# Altium project altum-senior-project-large.PrjPcb
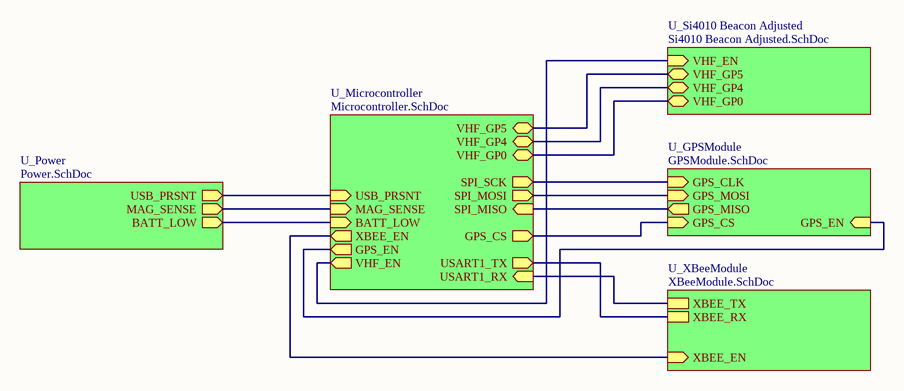
[diagram p0: topLevel.SchDoc]
6 sheets, 92 parts. Net scope: hierarchical (ports join the sheet entries above them; power ports are global).
Board file: largeCollar_AA.PcbDoc
Sheets:
  topLevel.SchDoc
    U_Power = Power.SchDoc
    U_GPSModule = GPSModule.SchDoc
    U_Microcontroller = Microcontroller.SchDoc
    U_Si4010 Beacon Adjusted = Si4010 Beacon Adjusted.SchDoc
    U_XBeeModule = XBeeModule.SchDoc

## Sheet topLevel.SchDoc: Top Level Schematic
size A4; Organization: Grand Valley State University; Address1: 301 W Fulton St; Address2: Grand Rapids, MI; Address3: 49504; Revision: AA; SheetNumber: 1; SheetTotal: 6; ImagePath: "D:\git\altium-senior-project\gvsu_logo.jpg"

### Sub-sheets
U_GPSModule = GPSModule.SchDoc: GPS_CLK (in), GPS_MISO (out), GPS_MOSI (in), GPS_CS (in), GPS_EN (in)
U_Microcontroller = Microcontroller.SchDoc: SPI_SCK (out), SPI_MISO (in), SPI_MOSI (out), GPS_CS (out), XBEE_EN (out), GPS_EN (out), VHF_EN (out), USB_PRSNT (in), MAG_SENSE (in), VHF_GP5 (bidir), VHF_GP4 (bidir), VHF_GP0 (bidir), BATT_LOW (in), USART1_TX (out), USART1_RX (in)
U_Power = Power.SchDoc: USB_PRSNT (out), MAG_SENSE (out), BATT_LOW (out)
U_Si4010 Beacon Adjusted = Si4010 Beacon Adjusted.SchDoc: VHF_EN (in), VHF_GP5 (bidir), VHF_GP4 (bidir), VHF_GP0 (bidir)
U_XBeeModule = XBeeModule.SchDoc: XBEE_EN (in), XBEE_TX, XBEE_RX

### Nets
GP0: sheet U_Microcontroller/VHF_GP0, sheet U_Si4010 Beacon Adjusted/VHF_GP0
GP4: sheet U_Microcontroller/VHF_GP4, sheet U_Si4010 Beacon Adjusted/VHF_GP4
GP5: sheet U_Microcontroller/VHF_GP5, sheet U_Si4010 Beacon Adjusted/VHF_GP5
GPS_CS: sheet U_GPSModule/GPS_CS, sheet U_Microcontroller/GPS_CS
MISO: sheet U_GPSModule/GPS_MISO, sheet U_Microcontroller/SPI_MISO
MOSI: sheet U_GPSModule/GPS_MOSI, sheet U_Microcontroller/SPI_MOSI
SCK: sheet U_GPSModule/GPS_CLK, sheet U_Microcontroller/SPI_SCK
NetQ2_2: sheet U_Power/USB_PRSNT, sheet U_Microcontroller/USB_PRSNT
NetR2_2: sheet U_Power/MAG_SENSE, sheet U_Microcontroller/MAG_SENSE
NetR5_1: sheet U_GPSModule/GPS_EN, sheet U_Microcontroller/GPS_EN
NetR11_1: sheet U_Microcontroller/VHF_EN, sheet U_Si4010 Beacon Adjusted/VHF_EN
NetR14_1: sheet U_Microcontroller/XBEE_EN, sheet U_XBeeModule/XBEE_EN
NetU1_6: sheet U_Microcontroller/USART1_RX, sheet U_XBeeModule/XBEE_TX
NetU1_7: sheet U_Microcontroller/USART1_TX, sheet U_XBeeModule/XBEE_RX
NetU1_25: sheet U_Power/BATT_LOW, sheet U_Microcontroller/BATT_LOW

### Notes on the sheet
- Title
- Size:
- Date:
- A4
- Number:
- Time:
- Revision:
- Sheet
- of
- File:

## Sheet Power.SchDoc: Power Selection
size A4; Revision: AA; SheetNumber: 4; SheetTotal: 6
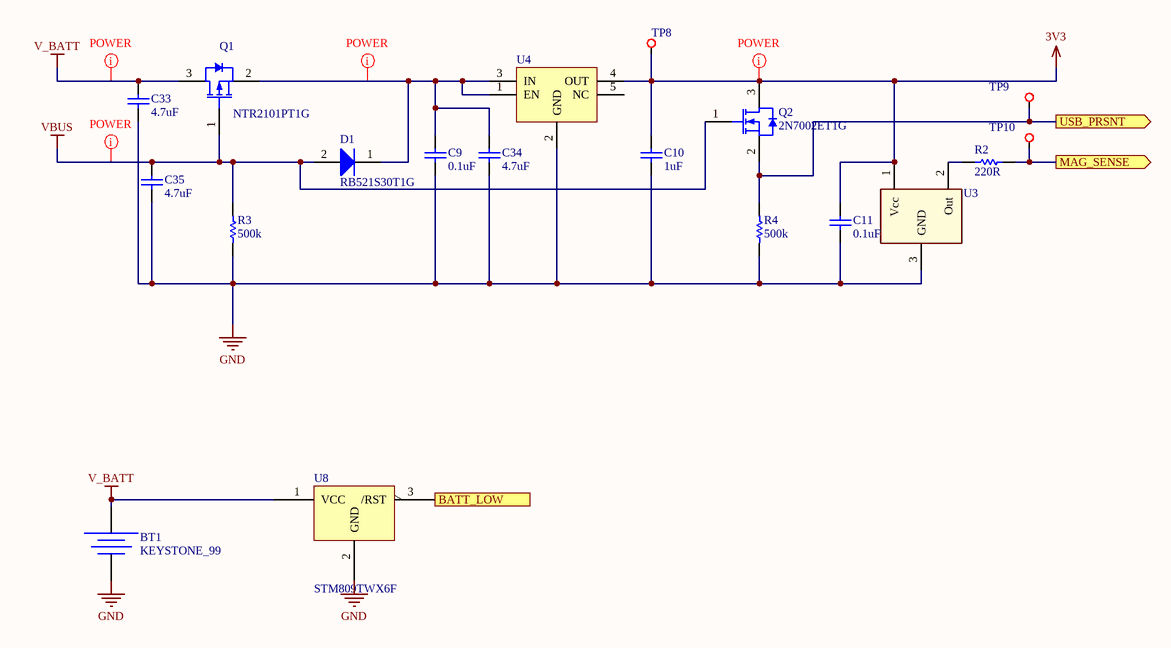
[diagram p1: Power.SchDoc]

### Parts
BT1  KEYSTONE_99  [KEYSTONE_99]
C9  value 0.1uF  [0402cap]  (hidden comment: C0402)
C10  value 1uF  [0402cap]  (hidden comment: C0402)
C11  value 0.1uF  [0402cap]  (hidden comment: C0402)
C33  value 4.7uF  [0603CAP]  (hidden comment: C0603)
C34  value 4.7uF  [0603CAP]  (hidden comment: C0603)
C35  value 4.7uF  [0603CAP]  (hidden comment: C0603)
D1  RB521S30T1G  [ONSC-SOD-523-2-502-01_V]
Q1  NTR2101PT1G  [ONSC-SOT-23-3-318-08_V]
Q2  2N7002ET1G  [ONSC-SOT-23-3-318-08_V]
R2  value 220R  [0402RES]  (hidden comment: R0402)
R3  value 500k  [0402RES]  (hidden comment: R0402)
R4  value 500k  [0402RES]  (hidden comment: R0402)
TP8  TESTPOINT  [TP R25]  (value not drawn)  (no BOM)
TP9  TESTPOINT  [TP R25]  (value not drawn)  (no BOM)
TP10  TESTPOINT  [TP R25]  (value not drawn)  (no BOM)
U3  DRV5032FBDBZT  [SOT-23]  (value not drawn)
U4  IC REG LINEAR 3.3V 200MA ESV  [TCR2EE33,LM(CT]  (value not drawn)
U8  STM809TWX6F  [SOT103P237X112-3N]

### Ports
BATT_LOW (out), MAG_SENSE (out), USB_PRSNT (out)

### Nets
3V3: C10.2 C11.2 Q2.3(D) TP8.1 U3.1(Vcc) U4.4(OUT)
GND: BT1.2(NEG) C9.1 C10.1 C11.1 C33.1 C34.1 C35.1 R3.1 R4.1 U3.3(GND) U4.2(GND) U8.2(GND)
V_BATT: BT1.1(POS) C33.2 Q1.3(D) U8.1(VCC)
VBUS: C35.2 D1.2(A) Q1.1(G) Q2.1(G) R3.2
NetC9_2: C9.2 C34.2 D1.1(K) Q1.2(S) U4.1(EN) U4.3(IN)
NetQ2_2: Q2.2(S) R4.2 TP9.1 ; port USB_PRSNT
NetR2_1: R2.1 U3.2(Out)
NetR2_2: R2.2 TP10.1 ; port MAG_SENSE
NetU1_25: U8.3(/RST) ; port BATT_LOW

Not connected (* = marked no-connect by the designer): U4 5(NC)

### Layout directives
net class POWER: 3V3, NetC9_2, V_BATT, VBUS

### Notes on the sheet
- Title
- Size:
- Date:
- A4
- Number:
- Time:
- Revision:
- Sheet
- of
- Grand Valley State University
- 301 W Fulton St
- Grand Rapids, MI
- 49504
- File:

### Library data of the parts
BT1 = KEYSTONE_99: Manufacturer 1: Keystone Electronics; Manufacturer Part Number 1: 99; Supplier 1: Digikey; Supplier Part Number 1: 36-99-ND
C9 C11 = C0402: 0402 Ceramic Chip Capacitor - Standard; Manufacturer 1: Samsung; Manufacturer Part Number 1: CL05B104KO5NNNC; Supplier 1: Digi-Key; Supplier Part Number 1: 1276-1001-1-ND
C10 = C0402: 0402 Ceramic Chip Capacitor - Standard
C33-C35 = C0603: 0603 Ceramic Chip Capacitor - Standard
D1 = CMP-1051-00018-1: Schottky Barrier Diode, 2-Pin SOD-523, Pb-Free, Tape and Reel; Manufacturer: On Semiconductor; Configuration: Single; IFSM Max (A): 1; Mounting Technology: Surface Mount; ComponentLink1Description: Manufacturer URL; PackageReference: SOD-523-2-502-01; RoHS: TRUE; ComponentLink3Description: Package Specification; ComponentLink2Description: Datasheet; PackageVersion: Rev. E, 09/2010; PartNumber: RB521S30T1G; ComponentLink3URL: http://www.onsemi.com/pub_link/Collateral/502-01.PDF; ComponentLink1URL: http://www.onsemi.com/; PackageDescription: 2-Pin SOD, Body 1.2 x 0.8 mm; DatasheetVersion: Rev. 8; ComponentLink2URL: http://www.onsemi.cn/pub_link/Collateral/RB521S30T1-D.PDF; Packing: Tape and Reel
Q1 = NTR2101PT1G: Small Signal MOSFET, -8 V, -3.7 A, Single P-Channel, 3-Pin SOT-23, Pb-Free, Tape and Reel; Manufacturer 1: On Semiconductor; Channel Polarity: P Channel; Ciss Typ (pF): 1173; Coss Typ (pF): 289; Crss Typ (pF): 218; ID Max (A): 3.7; PD Max (W): 0.96; V(BR)DSS Min (V): 8; VGS(th) Max (V): 1; DatasheetVersion: Rev. 6; PackageVersion: Rev. AP, 11/2009; PackageReference: SOT-23-3-318-08; PackageDescription: 3-Pin Small Outline Transistor, Body 2.92 x 1.3 mm, Pitch 0.95 mm; Configuration: Single; Package Type: SOT-23-3; Packing: Tape and Reel; RoHS: Pb-Free; VGS Max (V): 8; Mounting Technology: Surface Mount; Manufacturer Part Number 1: NTR2101PT1G; ComponentLink1Description: Manufacturer URL; ComponentLink1URL: http://www.onsemi.com/; ComponentLink2Description: Datasheet; ComponentLink2URL: http://www.onsemi.cn/pub_link/Collateral/NTR2101P-D.PDF; ComponentLink3Description: Package Specification; ComponentLink3URL: http://www.onsemi.cn/pub_link/Collateral/318-08.PDF
Q2 = 2N7002ET1G: Small Signal MOSFET, 60 V, 310 mA, Single, N-Channel, 3-Pin SOT-23, Pb-Free, Tape and Reel; Manufacturer: On Semiconductor; Channel Polarity: N Channel; Ciss Typ (pF): 26.7; Coss Typ (pF): 4.6; Crss Typ (pF): 2.9; ID Max (A): 0.31; V(BR)DSS Min (V): 60; VGS Max (V): 20; VGS(th) Max (V): 2.5; DatasheetVersion: Rev. 3; PackageVersion: Rev. AP, 11/2009; PackageReference: SOT-23-3-318-08; PackageDescription: 3-Pin Small Outline Transistor, Body 2.92 x 1.3 mm, Pitch 0.95 mm; Supplier 1: Digi-Key; Supplier Part Number 1: 2N7002ET1GOSTR-ND; Supplier 2: Digi-Key; Supplier Part Number 2: 2N7002ET1GOSCT-ND; Supplier 3: Digi-Key; Supplier Part Number 3: 2N7002ET1GOSDKR-ND; Supplier 4: Farnell; Supplier Part Number 4: 2317895; Supplier 5: Farnell; Supplier Part Number 5: 2317616; Supplier 6: Newark; Supplier Part Number 6: 09R9861; Supplier 7: Newark; Supplier Part Number 7: 50M2216; Supplier 8: Mouser; Supplier Part Number 8: 863-2N7002ET1G; Configuration: Single; Package Type: SOT-23-3; Packing: Tape and Reel; RoHS: Pb-Free; Mounting Technology: Surface Mount; PartNumber: 2N7002ET1G; ComponentLink1Description: Manufacturer URL; ComponentLink1URL: http://www.onsemi.com/; ComponentLink2Description: Datasheet; ComponentLink2URL: http://www.onsemi.com/pub_link/Collateral/2N7002E-D.PDF; ComponentLink3Description: Package Specification; ComponentLink3URL: http://www.onsemi.cn/pub_link/Collateral/318-08.PDF
R2-R4 = R0402: 0402 Chip Resistor - Standard; ComponentLink1URL: *
TP8-TP10 = TP25: 0.025" Round Test Point; Part Number: 1613; Part Name: Testpoint
U3 = DRV5032FBDBZT: Hall Effect Sensor; Manufacturer: *; Manufacturer PN: *; Vendor: *; Vendor PN: *; Price: *
U4 = TCR2EE33,LM(CT: Linear Voltage Regulator IC Positive Fixed 1 Output  200mA ESV; Manufacturer 1: Toshiba Semiconductor and Storage; Manufacturer Part Number 1: TCR2EE33,LM(CT; Supplier 1: Digikey; Supplier Part Number 1: TCR2EE33LM(CTCT-ND; ComponentLink1Description: Datasheet; ComponentLink1URL: https://toshiba.semicon-storage.com/info/docget.jsp?did=13794&prodName=TCR2EF45
U8 = STM809TWX6F: IC MPU RESET CIRC 3.08V SOT23; Manufacturer 1: STMicroelectronics; Manufacturer Part Number 1: STM809TWX6F; Supplier 1: Digi-Key; Supplier Part Number 1: 497-3339-1-ND; ComponentLink1Description: Datasheet; ComponentLink1URL: https://www.st.com/content/ccc/resource/technical/document/datasheet/cd/e2/ab/27/7d/5d/44/41/CD00003591.pdf/files/CD00003591.pdf/jcr:content/translations/en.CD00003591.pdf

## Sheet GPSModule.SchDoc
size A4; Revision: AA; SheetNumber: 3; SheetTotal: 6
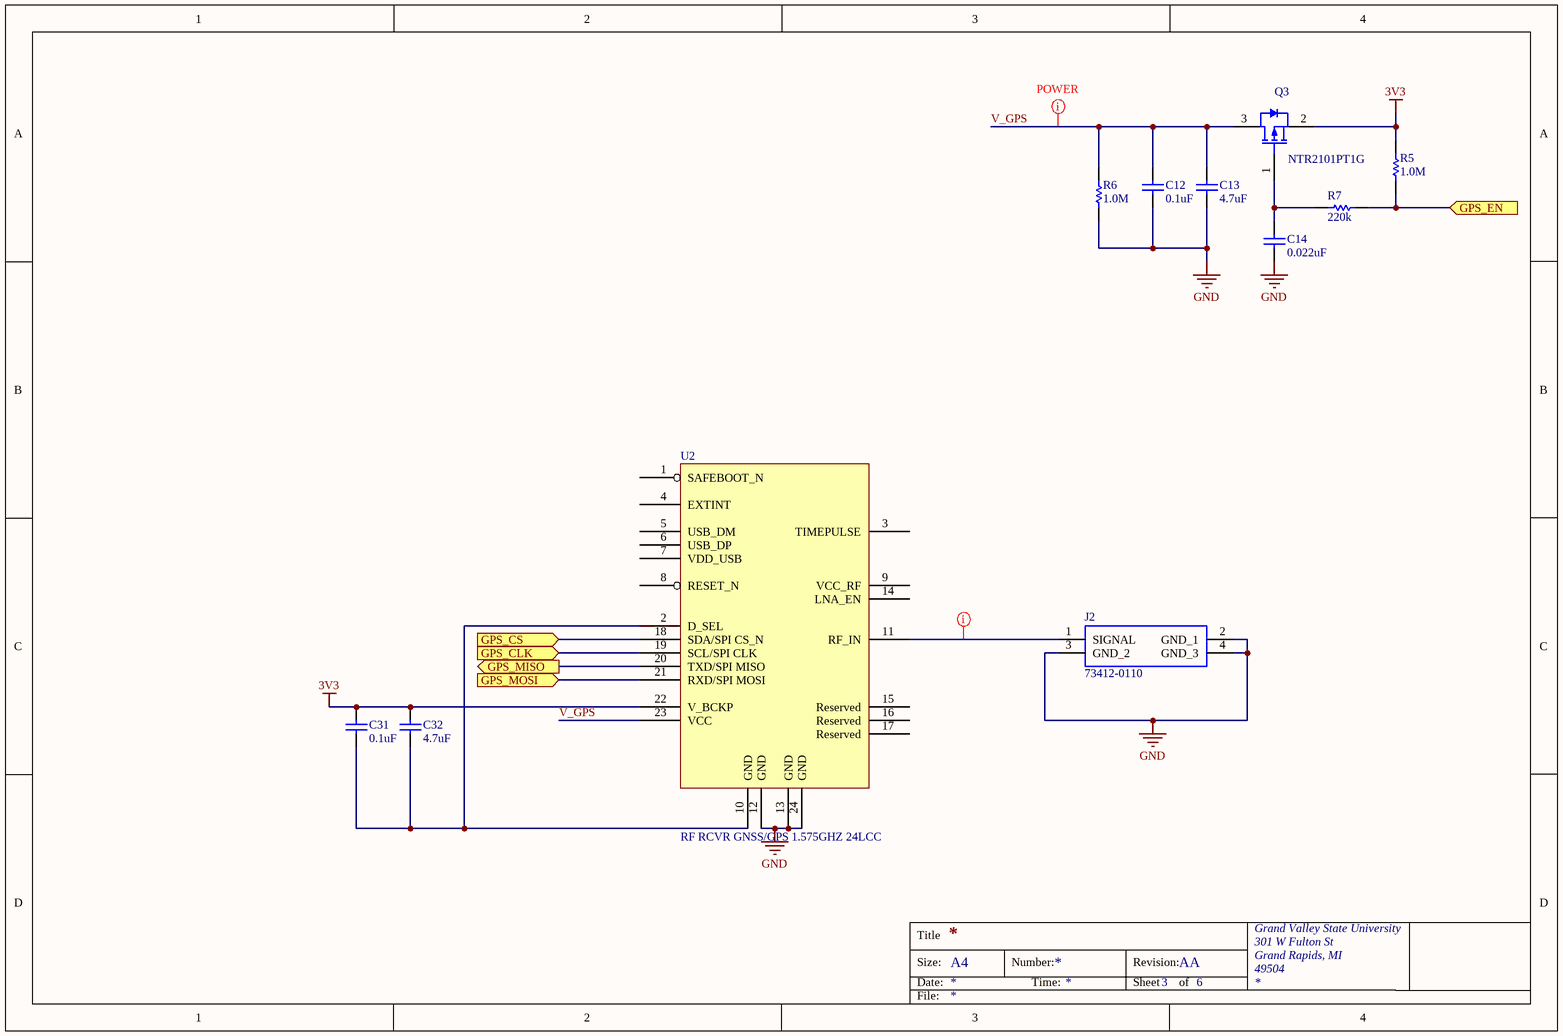
[diagram p2: GPSModule.SchDoc]

### Parts
C12  value 0.1uF  [0402cap]  (hidden comment: C0402)
C13  value 4.7uF  [0603CAP]  (hidden comment: C0603)
C14  value 0.022uF  [0402cap]  (hidden comment: C0402)
C31  value 0.1uF  [0402cap]  (hidden comment: C0402)
C32  value 4.7uF  [0603CAP]  (hidden comment: C0603)
J2  73412-0110  [73412-0110]
Q3  NTR2101PT1G  [ONSC-SOT-23-3-318-08_V]
R5  value 1.0M  [0402RES]  (hidden comment: R0402)
R6  value 1.0M  [0402RES]  (hidden comment: R0402)
R7  value 220k  [0402RES]  (hidden comment: R0402)
U2  RF RCVR GNSS/GPS 1.575GHZ 24LCC  [NEO-M8N-0]

### Ports
GPS_CLK (in), GPS_CS (in), GPS_EN (in), GPS_MISO (out), GPS_MOSI (in)

### Nets
3V3: C31.2 C32.2 Q3.2(S) R5.2 U2.22(V_BCKP)
GND: C12.1 C13.1 C14.1 J2.2(GND_1) J2.3(GND_2) J2.4(GND_3) R6.1 U2.12(GND) U2.13(GND) U2.24(GND)
GPS_CS: U2.18(SDA/SPI_CS_N) ; port GPS_CS
MISO: U2.20(TXD/SPI_MISO) ; port GPS_MISO
MOSI: U2.21(RXD/SPI_MOSI) ; port GPS_MOSI
SCK: U2.19(SCL/SPI_CLK) ; port GPS_CLK
V_GPS: C12.2 C13.2 Q3.3(D) R6.2 U2.23(VCC)
NetC14_2: C14.2 Q3.1(G) R7.2
NetC31_1: C31.1 C32.1 U2.2(D_SEL) U2.10(GND)
NetJ2_1: J2.1(SIGNAL) U2.11(RF_IN)
NetR5_1: R5.1 R7.1 ; port GPS_EN

Not connected (* = marked no-connect by the designer): U2 1(SAFEBOOT_N) 3(TIMEPULSE) 4(EXTINT) 5(USB_DM) 6(USB_DP) 7(VDD_USB) 8(RESET_N) 9(VCC_RF) 14(LNA_EN) 15(Reserved) 16(Reserved) 17(Reserved)

### Layout directives
net class POWER: V_GPS
net class 50_OHM: NetJ2_1

### Notes on the sheet
- Title
- Size:
- Date:
- A4
- Number:
- Time:
- Revision:
- Sheet
- of
- Grand Valley State University
- 301 W Fulton St
- Grand Rapids, MI
- 49504
- File:

### Library data of the parts
C12 C31 = C0402: 0402 Ceramic Chip Capacitor - Standard
C13 C32 = C0603: 0603 Ceramic Chip Capacitor - Standard
C14 = C0402: 0402 Ceramic Chip Capacitor - Standard; Manufacturer 1: Taiyo Yuden; Manufacturer Part Number 1: EMK105B7223KV-F; Supplier 1: Digi-Key; Supplier Part Number 1: 587-1224-1-ND
J2 = 73412-0110: 50 Ohms, MCRF, PCB Vertical Jack Receptacle, SMT, 1.25mm Mounted Height; Manufacturer_Name: Molex; Allied_Number: 70357960; Manufacturer_Part_Number: 73412-0110; RS Part Number: 1676350; RS Price/Stock: http://uk.rs-online.com/web/p/products/1676350; Allied Price/Stock: https://www.alliedelec.com/molex-incorporated-73412-0110/70357960/; Mouser Part Number: 538-73412-0110; Mouser Price/Stock: https://www.mouser.com/Search/Refine.aspx?Keyword=538-73412-0110; Datasheet Link: http://www.molex.com/pdm_docs/sd/734120110_sd.pdf
Q3 = NTR2101PT1G: as Q1 on sheet Power; DatasheetVersion: Rev. 6; PackageVersion: Rev. AP, 11/2009; PackageReference: SOT-23-3-318-08; PackageDescription: 3-Pin Small Outline Transistor, Body 2.92 x 1.3 mm, Pitch 0.95 mm; Configuration: Single; Package Type: SOT-23-3; Packing: Tape and Reel; RoHS: Pb-Free; VGS Max (V): 8; Mounting Technology: Surface Mount; Manufacturer Part Number 1: NTR2101PT1G; ComponentLink1Description: Manufacturer URL; ComponentLink1URL: http://www.onsemi.com/; ComponentLink2Description: Datasheet; ComponentLink2URL: http://www.onsemi.cn/pub_link/Collateral/NTR2101P-D.PDF; ComponentLink3Description: Package Specification; ComponentLink3URL: http://www.onsemi.cn/pub_link/Collateral/318-08.PDF
R5-R7 = R0402: 0402 Chip Resistor - Standard; ComponentLink1URL: *
U2 = NEO-M8N-0: Concurrent GNSS LCC module, TCXO, Flash, SAW, LNA; Manufacturer 1: U-Blox America Inc.; Manufacturer Part Number 1: NEO-M8N-0; Supplier 1: Digi-Key; Supplier Part Number 1: 672-1008-1-ND

## Sheet Microcontroller.SchDoc: Microcontroller
size A4; Revision: AA; SheetNumber: 2; SheetTotal: 6; ImagePath: "D:\git\altium-senior-project\gvsu_logo.jpg"
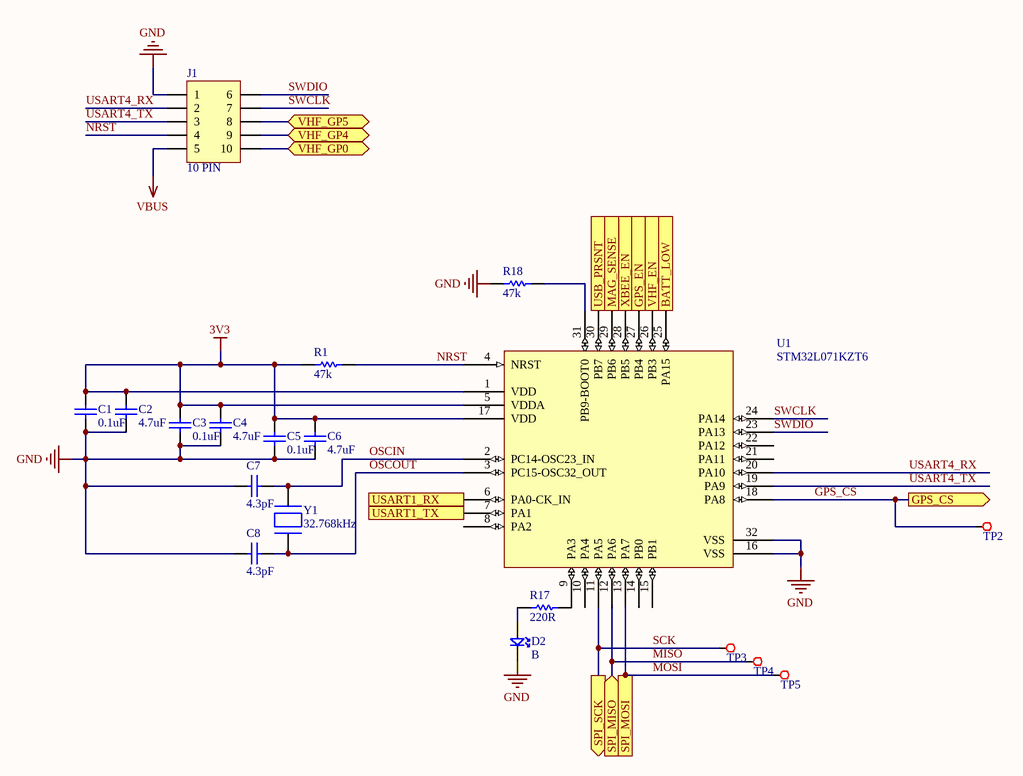
[diagram p3: Microcontroller.SchDoc]

### Parts
C1  value 0.1uF  [0402cap]  (hidden comment: C0402)
C2  value 4.7uF  [0603CAP]  (hidden comment: C0603)
C3  value 0.1uF  [0402cap]  (hidden comment: C0402)
C4  value 4.7uF  [0603CAP]  (hidden comment: C0603)
C5  value 0.1uF  [0402cap]  (hidden comment: C0402)
C6  value 4.7uF  [0603CAP]  (hidden comment: C0603)
C7  value 4.3pF  [0402cap]  (hidden comment: C0402)
C8  value 4.3pF  [0402cap]  (hidden comment: C0402)
D2  value B  [0603DDE]  (hidden comment: D0603)
J1  10 PIN  [FTSH-105-01-F-D-K]
R1  value 47k  [0402RES]  (hidden comment: R0402)
R17  value 220R  [0402RES]  (hidden comment: R0402)
R18  value 47k  [0402RES]  (hidden comment: R0402)
TP2  TESTPOINT  [TP R35 TH15]  (value not drawn)  (no BOM)
TP3  TESTPOINT  [TP R35 TH15]  (value not drawn)  (no BOM)
TP4  TESTPOINT  [TP R35 TH15]  (value not drawn)  (no BOM)
TP5  TESTPOINT  [TP R35 TH15]  (value not drawn)  (no BOM)
U1  STM32L071KZT6  [LQFP32]
Y1  32.768kHz  [0.126" L x 0.061" W (2 PAD)]

### Ports
BATT_LOW (in), GPS_CS (out), GPS_EN (out), MAG_SENSE (in), SPI_MISO (in), SPI_MOSI (out), SPI_SCK (out), USART1_RX (in), USART1_TX (out), USB_PRSNT (in), VHF_EN (out), VHF_GP0 (bidir), VHF_GP4 (bidir), VHF_GP5 (bidir), XBEE_EN (out)

### Nets
3V3: C1.2 C2.2 C3.2 C4.2 C5.2 C6.2 R1.1 U1.1(VDD) U1.5(VDDA) U1.17(VDD)
GND: C1.1 C2.1 C3.1 C4.1 C5.1 C6.1 C7.1 C8.1 D2.2 J1.1 R18.1 U1.16(VSS) U1.32(VSS)
VBUS: J1.5
GP0: J1.10 ; port VHF_GP0
GP4: J1.9 ; port VHF_GP4
GP5: J1.8 ; port VHF_GP5
GPS_CS: TP2.1 U1.18(PA8) ; port GPS_CS
MISO: TP4.1 U1.12(PA6) ; port SPI_MISO
MOSI: TP5.1 U1.13(PA7) ; port SPI_MOSI
NRST: J1.4 R1.2 U1.4(NRST)
OSCIN: C7.2 U1.2(PC14-OSC23_IN) Y1.2
OSCOUT: C8.2 U1.3(PC15-OSC32_OUT) Y1.1
SCK: TP3.1 U1.11(PA5) ; port SPI_SCK
SWCLK: J1.7 U1.24(PA14)
SWDIO: J1.6 U1.23(PA13)
USART4_RX: J1.2 U1.20(PA10)
USART4_TX: J1.3 U1.19(PA9)
NetD2_1: D2.1 R17.1
NetQ2_2: U1.30(PB7) ; port USB_PRSNT
NetR2_2: U1.29(PB6) ; port MAG_SENSE
NetR5_1: U1.27(PB4) ; port GPS_EN
NetR11_1: U1.26(PB3) ; port VHF_EN
NetR14_1: U1.28(PB5) ; port XBEE_EN
NetR17_2: R17.2 U1.9(PA3)
NetR18_2: R18.2 U1.31(PB9-BOOT0)
NetU1_6: U1.6(PA0-CK_IN) ; port USART1_RX
NetU1_7: U1.7(PA1) ; port USART1_TX
NetU1_25: U1.25(PA15) ; port BATT_LOW

Not connected (* = marked no-connect by the designer): U1 8(PA2) 10(PA4) 14(PB0) 15(PB1) 21(PA11) 22(PA12)

### Notes on the sheet
- Title
- Size:
- Date:
- A4
- Number:
- Time:
- Revision:
- Sheet
- of
- Grand Valley State University
- 301 W Fulton St
- Grand Rapids, MI
- 49504
- File:

### Library data of the parts
C1 C3 C5 = C0402: as C9 on sheet Power; Supplier 1: Digi-Key; Supplier Part Number 1: 1276-1001-1-ND
C2 C4 C6 = C0603: 0603 Ceramic Chip Capacitor - Standard
C7 C8 = C0402: 0402 Ceramic Chip Capacitor - Standard
D2 = D0603: 0603 SMD LED; ComponentLink1URL: *; Forward Voltage Drop: *
J1 = FTSH-105-01-F-D-K: 10 Pin Programming Header; Manufacturer 1: Samtec Inc.; Manufacturer Part Number 1: FTSH-105-01-F-D-K; Supplier 1: Digikey; Supplier Part Number 1: SAM8909-ND
R1 R17 R18 = R0402: 0402 Chip Resistor - Standard; ComponentLink1URL: *
TP2-TP5 = TP35TH10: 0.035"/0.015" Thru Hole Test Point; Part Number: 1617; Part Name: Testpoint
U1 = STM32L011K4T6: STMicro ARM M0+ Microcontroller; Manufacturer 1: STMicroelectronics; Manufacturer Part Number 1: STM32L071KZT6; Supplier 1: Digikey; Supplier Part Number 1: 497-18578-ND
Y1 = NX3215SA-32.768K-STD-MUA-8: NDK RTC 12.5pF Crystal SMD; Manufacturer 1: NDK; Manufacturer Part Number 1: NX3215SA-32.768K-STD-MUA-8; Supplier 1: Digikey; Supplier Part Number 1: 644-1156-1-ND

## Sheet Si4010 Beacon Adjusted.SchDoc: VHF Beacon
size A4; Revision: AA; SheetNumber: 5; SheetTotal: 6
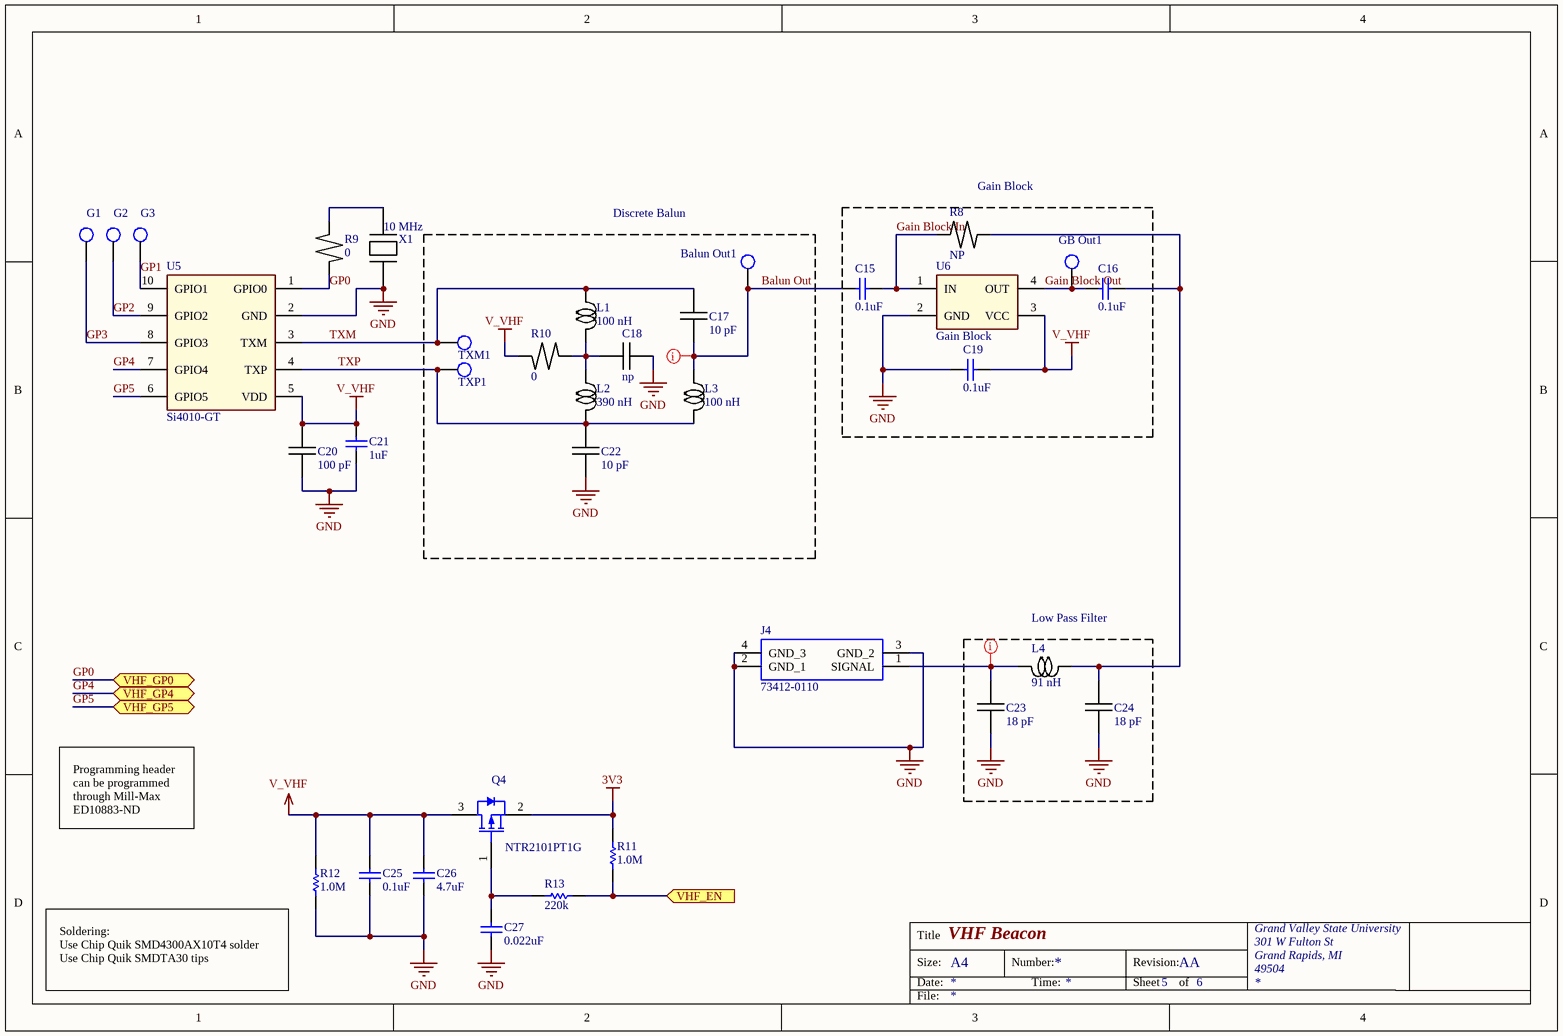
[diagram p4: Si4010 Beacon Adjusted.SchDoc]

### Parts
Balun_Out1  Test Point  [Test Point-SM35]  (value not drawn)  (no BOM)
C15  value 0.1uF  [0402cap]  (hidden comment: C0402)
C16  value 0.1uF  [0402cap]  (hidden comment: C0402)
C17  value 10 pF  [Capacitor - 0402]  (hidden comment: Chip Capacitor)
C18  value np  [Capacitor - 0402]  (hidden comment: Chip Capacitor)
C19  value 0.1uF  [0402cap]  (hidden comment: C0402)
C20  value 100 pF  [Capacitor - 0402]  (hidden comment: Chip Capacitor)
C21  value 1uF  [0402cap]  (hidden comment: C0402)
C22  value 10 pF  [Capacitor - 0402]  (hidden comment: Chip Capacitor)
C23  value 18 pF  [Capacitor - 0402]  (hidden comment: Chip Capacitor)
C24  value 18 pF  [Capacitor - 0402]  (hidden comment: Chip Capacitor)
C25  value 0.1uF  [0402cap]  (hidden comment: C0402)
C26  value 4.7uF  [0603CAP]  (hidden comment: C0603)
C27  value 0.022uF  [0402cap]  (hidden comment: C0402)
G1  Test Point  [Test Point-SM55]  (value not drawn)  (no BOM)
G2  Test Point  [Test Point-SM55]  (value not drawn)  (no BOM)
G3  Test Point  [Test Point-SM55]  (value not drawn)  (no BOM)
GB_Out1  Test Point  [Test Point-SM35]  (value not drawn)  (no BOM)
J4  73412-0110  [73412-0110]
L1  value 100 nH  [Inductor - 0402]  (hidden comment: 0402)
L2  value 390 nH  [Inductor - 0402]  (hidden comment: 0402)
L3  value 100 nH  [Inductor - 0402]  (hidden comment: 0402)
L4  value 91 nH  [Inductor - 0402]  (hidden comment: 0402)
Q4  NTR2101PT1G  [ONSC-SOT-23-3-318-08_V]
R8  value NP  [Resistor - 0402]  (hidden comment: Chip Resistor)
R9  value 0  [Resistor - 0402]  (hidden comment: Chip Resistor)
R10  value 0  [Resistor - 0402]  (hidden comment: Chip Resistor)
R11  value 1.0M  [0402RES]  (hidden comment: R0402)
R12  value 1.0M  [0402RES]  (hidden comment: R0402)
R13  value 220k  [0402RES]  (hidden comment: R0402)
TXM1  Test Point  [Test Point-SM35]  (value not drawn)  (no BOM)
TXP1  Test Point  [Test Point-SM35]  (value not drawn)  (no BOM)
U5  Si4010-GT  [MSOP10]
U6  Gain Block  [BGA427]
X1  value 10 MHz  [ECS Crystal]  (hidden comment: Crystal)

### Blocks framed on the sheet
Discrete Balun: Balun_Out1 C17 C18 C22 L1-L3 R10 TXM1 TXP1
Gain Block: C15 C16 C19 GB_Out1 R8 U6
Low Pass Filter: C23 C24 L4

### Ports
VHF_EN (in), VHF_GP0 (bidir), VHF_GP4 (bidir), VHF_GP5 (bidir)

### Nets
3V3: Q4.2(S) R11.2
GND: C18.1 C19.1 C20.2 C21.1 C22.1 C23.2 C24.2 C25.1 C26.1 C27.1 J4.2(GND_1) J4.3(GND_2) J4.4(GND_3) R12.1 U5.2(GND) U6.2(GND) X1.1
V_VHF: C19.2 C20.1 C21.2 C25.2 C26.2 Q4.3(D) R10.1 R12.2 U5.5(VDD) U6.3(VCC)
Balun Out: Balun_Out1.1 C15.1 C17.1 L3.1
Gain Block In: C15.2 R8.1 U6.1(IN)
Gain Block Out: C16.1 GB_Out1.1 U6.4(OUT)
GP0: R9.2 U5.1(GPIO0) ; port VHF_GP0
GP1: G3.1 U5.10(GPIO1)
GP2: G2.1 U5.9(GPIO2)
GP3: G1.1 U5.8(GPIO3)
GP4: U5.7(GPIO4) ; port VHF_GP4
GP5: U5.6(GPIO5) ; port VHF_GP5
TXM: C17.2 L1.1 TXM1.1 U5.3(TXM)
TXP: C22.2 L2.2 L3.2 TXP1.1 U5.4(TXP)
NetC16_2: C16.2 C24.1 L4.2 R8.2
NetC18_2: C18.2 L1.2 L2.1 R10.2
NetC23_1: C23.1 J4.1(SIGNAL) L4.1
NetC27_2: C27.2 Q4.1(G) R13.2
NetR9_1: R9.1 X1.3
NetR11_1: R11.1 R13.1 ; port VHF_EN

### Layout directives
net class 50_OHM: Balun Out, NetC23_1

### Notes on the sheet
- Programming header can be programmed through Mill-Max ED10883-ND
- (near R12) Soldering:
  Use Chip Quik SMD4300AX10T4 solder
  Use Chip Quik SMDTA30 tips
- Title
- Size:
- Date:
- A4
- Number:
- Time:
- Revision:
- Sheet
- of
- Grand Valley State University
- 301 W Fulton St
- Grand Rapids, MI
- 49504
- File:

### Library data of the parts
C15 C16 C19 = C0402: as C9 on sheet Power; Supplier 1: Digi-Key; Supplier Part Number 1: 1276-1001-1-ND
C17 = Chip Capacitor: Manufacturer 1: Murata; Manufacturer Part Number 1: GCM1555C1H100FA16D; Vendor: *; Vendor PN: *; Price: 0.14
C20 = Chip Capacitor: Manufacturer 1: Murata Electronics North America; Manufacturer Part Number 1: GRM1555C1H101JA01J; Supplier 1: Digi-Key; Supplier Part Number 1: 490-7754-1-ND; Price: 0.1
C21 C25 = C0402: 0402 Ceramic Chip Capacitor - Standard
C23 C24 = Chip Capacitor: Manufacturer 1: Kemet; Manufacturer Part Number 1: CBR04C180F5GAC; Vendor: *; Vendor PN: *; Price: 0.32
C26 = C0603: 0603 Ceramic Chip Capacitor - Standard
C27 = C0402: as C14 on sheet GPSModule; Supplier 1: Digi-Key; Supplier Part Number 1: 587-1224-1-ND
J4 = 73412-0110: as J2 on sheet GPSModule; Manufacturer_Part_Number: 73412-0110; RS Part Number: 1676350; RS Price/Stock: http://uk.rs-online.com/web/p/products/1676350; Allied Price/Stock: https://www.alliedelec.com/molex-incorporated-73412-0110/70357960/; Mouser Part Number: 538-73412-0110; Mouser Price/Stock: https://www.mouser.com/Search/Refine.aspx?Keyword=538-73412-0110; Datasheet Link: http://www.molex.com/pdm_docs/sd/734120110_sd.pdf
L1 L3 = Inductor - 0402: 0402 Inductor; Manufacturer 1: TDK; Manufacturer Part Number 1: MLG1005SR10JT000; Vendor: *; Vendor PN: *; Price: 0.1
L2 = Inductor - 0402: 0402 Inductor; Manufacturer 1: TDK; Manufacturer Part Number 1: MHQ1005PR39HT000; Vendor: Digikey; Vendor PN: 445-175487-1-ND; Price: 0.28
L4 = Inductor - 0402: 0402 Inductor; Manufacturer 1: TDK; Manufacturer Part Number 1: MLG1005S91NJT000; Vendor: *; Vendor PN: *; Price: 0.1
Q4 = NTR2101PT1G: as Q1 on sheet Power; DatasheetVersion: Rev. 6; PackageVersion: Rev. AP, 11/2009; PackageReference: SOT-23-3-318-08; PackageDescription: 3-Pin Small Outline Transistor, Body 2.92 x 1.3 mm, Pitch 0.95 mm; Configuration: Single; Package Type: SOT-23-3; Packing: Tape and Reel; RoHS: Pb-Free; VGS Max (V): 8; Mounting Technology: Surface Mount; Manufacturer Part Number 1: NTR2101PT1G; ComponentLink1Description: Manufacturer URL; ComponentLink1URL: http://www.onsemi.com/; ComponentLink2Description: Datasheet; ComponentLink2URL: http://www.onsemi.cn/pub_link/Collateral/NTR2101P-D.PDF; ComponentLink3Description: Package Specification; ComponentLink3URL: http://www.onsemi.cn/pub_link/Collateral/318-08.PDF
R9 R10 = Chip Resistor: Manufacturer 1: Yageo; Manufacturer Part Number 1: RC0402JR-070RL; Vendor: *; Vendor PN: *; Price: 0.1
R11-R13 = R0402: 0402 Chip Resistor - Standard; ComponentLink1URL: *
U5 = Si4010-GT: Transmitter/MCU; Manufacturer: Silion Labs; Manufacturer PN: Si4010-C2-GT; Vendor: Digi-Key; Vendor PN: 336-4342-1-ND; Price: 3.75; Value: -
U6 = BGA427: Manufacturer: Infineon; Manufacturer PN: BGA427H6327XTSA1; Value: *; Price: 0.84; Vendor: *; Vendor PN: *
X1 = ECS 53B Crystal: Manufacturer: ECS; Manufacturer PN: ECS-100-10-30B-CKL-TR; Vendor: *; Vendor PN: *; Price: 0.69
Balun_Out1 G1-G3 GB_Out1 TXM1 TXP1 = Test Point: Manufacturer: *; Manufacturer PN: *; Vendor: *; Vendor PN: *; Price: *
C18 C22 = Chip Capacitor: Vendor: *; Vendor PN: *
  C18: Manufacturer: *; Manufacturer PN: *; Price: *
  C22: Manufacturer 1: *; Manufacturer Part Number 1: *; Price: 0.14
R8 = Chip Resistor: Vendor: *; Vendor PN: *; Manufacturer: *; Manufacturer PN: *; Price: *

## Sheet XBeeModule.SchDoc: XBEE Radio
size A4; Revision: AA; SheetNumber: 6; SheetTotal: 6
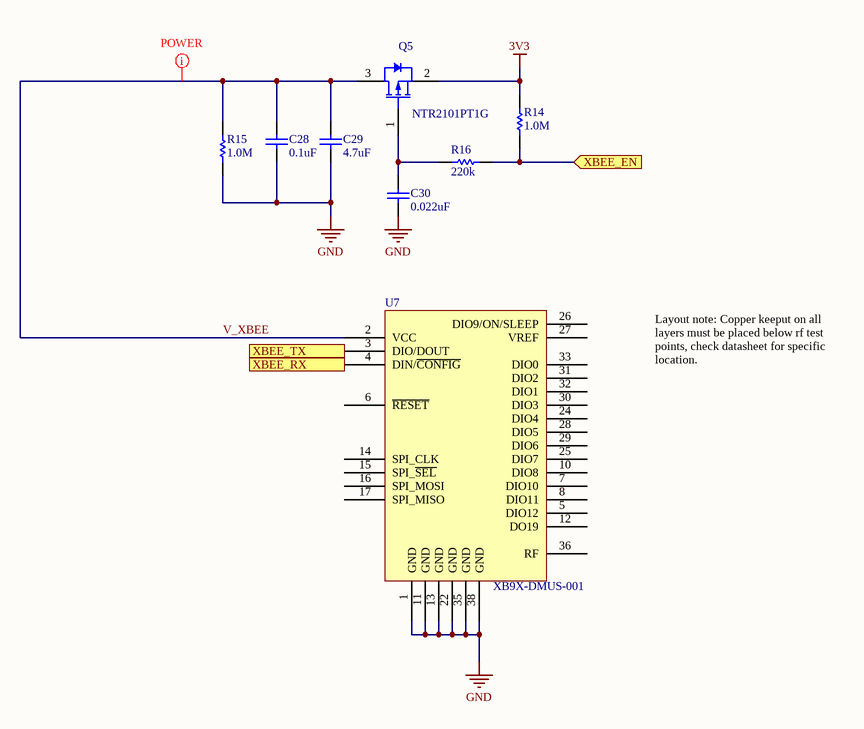
[diagram p5: XBeeModule.SchDoc]

### Parts
C28  value 0.1uF  [0402cap]  (hidden comment: C0402)
C29  value 4.7uF  [0603CAP]  (hidden comment: C0603)
C30  value 0.022uF  [0402cap]  (hidden comment: C0402)
Q5  NTR2101PT1G  [ONSC-SOT-23-3-318-08_V]
R14  value 1.0M  [0402RES]  (hidden comment: R0402)
R15  value 1.0M  [0402RES]  (hidden comment: R0402)
R16  value 220k  [0402RES]  (hidden comment: R0402)
U7  XB9X-DMUS-001  [XBee/XBee-PRO]

### Ports
XBEE_EN (in), XBEE_RX, XBEE_TX

### Nets
3V3: Q5.2(S) R14.2
GND: C28.1 C29.1 C30.1 R15.1 U7.1(GND) U7.11(GND) U7.13(GND) U7.22(GND) U7.35(GND) U7.38(GND)
V_XBEE: C28.2 C29.2 Q5.3(D) R15.2 U7.2(VCC)
NetC30_2: C30.2 Q5.1(G) R16.1
NetR14_1: R14.1 R16.2 ; port XBEE_EN
NetU1_6: U7.3(DIO/DOUT) ; port XBEE_TX
NetU1_7: U7.4(DIN/~{CONFIG}) ; port XBEE_RX

Not connected (* = marked no-connect by the designer): U7 5(DIO12) 6(~{RESET}) 7(DIO10) 8(DIO11) 10(DIO8) 12(DO19) 14(SPI_CLK) 15(SPI_~{SEL}) 16(SPI_MOSI) 17(SPI_MISO) 24(DIO4) 25(DIO7) 26(DIO9/ON/SLEEP) 27(VREF) 28(DIO5) 29(DIO6) 30(DIO3) 31(DIO2) 32(DIO1) 33(DIO0) 36(RF)

### Layout directives
net class POWER: V_XBEE

### Notes on the sheet
- Layout note: Copper keeput on all layers must be placed below rf test points, check datasheet for specific location.
- Title
- Size:
- Date:
- A4
- Number:
- Time:
- Revision:
- Sheet
- of
- Grand Valley State University
- 301 W Fulton St
- Grand Rapids, MI
- 49504
- File:

### Library data of the parts
C28 = C0402: 0402 Ceramic Chip Capacitor - Standard
C29 = C0603: 0603 Ceramic Chip Capacitor - Standard
C30 = C0402: as C14 on sheet GPSModule; Supplier 1: Digi-Key; Supplier Part Number 1: 587-1224-1-ND
Q5 = NTR2101PT1G: as Q1 on sheet Power; DatasheetVersion: Rev. 6; PackageVersion: Rev. AP, 11/2009; PackageReference: SOT-23-3-318-08; PackageDescription: 3-Pin Small Outline Transistor, Body 2.92 x 1.3 mm, Pitch 0.95 mm; Configuration: Single; Package Type: SOT-23-3; Packing: Tape and Reel; RoHS: Pb-Free; VGS Max (V): 8; Mounting Technology: Surface Mount; Manufacturer Part Number 1: NTR2101PT1G; ComponentLink1Description: Manufacturer URL; ComponentLink1URL: http://www.onsemi.com/; ComponentLink2Description: Datasheet; ComponentLink2URL: http://www.onsemi.cn/pub_link/Collateral/NTR2101P-D.PDF; ComponentLink3Description: Package Specification; ComponentLink3URL: http://www.onsemi.cn/pub_link/Collateral/318-08.PDF
R14-R16 = R0402: 0402 Chip Resistor - Standard; ComponentLink1URL: *

## Nets that join several sheets
3V3: Power (6 pins), GPSModule (5 pins), Microcontroller (10 pins), Si4010 Beacon Adjusted (Q4.2 R11.2), XBeeModule (Q5.2 R14.2)
GND: Power (12 pins), GPSModule (10 pins), Microcontroller (13 pins), Si4010 Beacon Adjusted (17 pins), XBeeModule (10 pins)
VBUS: Power (5 pins), Microcontroller (J1.5)
GP0: Microcontroller (J1.10), Si4010 Beacon Adjusted (R9.2 U5.1)
GP4: Microcontroller (J1.9), Si4010 Beacon Adjusted (U5.7)
GP5: Microcontroller (J1.8), Si4010 Beacon Adjusted (U5.6)
GPS_CS: GPSModule (U2.18), Microcontroller (TP2.1 U1.18)
MISO: GPSModule (U2.20), Microcontroller (TP4.1 U1.12)
MOSI: GPSModule (U2.21), Microcontroller (TP5.1 U1.13)
NetQ2_2: Power (Q2.2 R4.2 TP9.1), Microcontroller (U1.30)
NetR2_2: Power (R2.2 TP10.1), Microcontroller (U1.29)
NetR5_1: GPSModule (R5.1 R7.1), Microcontroller (U1.27)
NetR11_1: Microcontroller (U1.26), Si4010 Beacon Adjusted (R11.1 R13.1)
NetR14_1: Microcontroller (U1.28), XBeeModule (R14.1 R16.2)
NetU1_6: Microcontroller (U1.6), XBeeModule (U7.3)
NetU1_7: Microcontroller (U1.7), XBeeModule (U7.4)
NetU1_25: Power (U8.3), Microcontroller (U1.25)
SCK: GPSModule (U2.19), Microcontroller (TP3.1 U1.11)